# Altium schematic sheet SLIDER_PB.SchDoc
size A4; DocumentNumber: 6; Revision: C.1(PCB.SCH); SheetNumber: 6; SheetTotal: 6
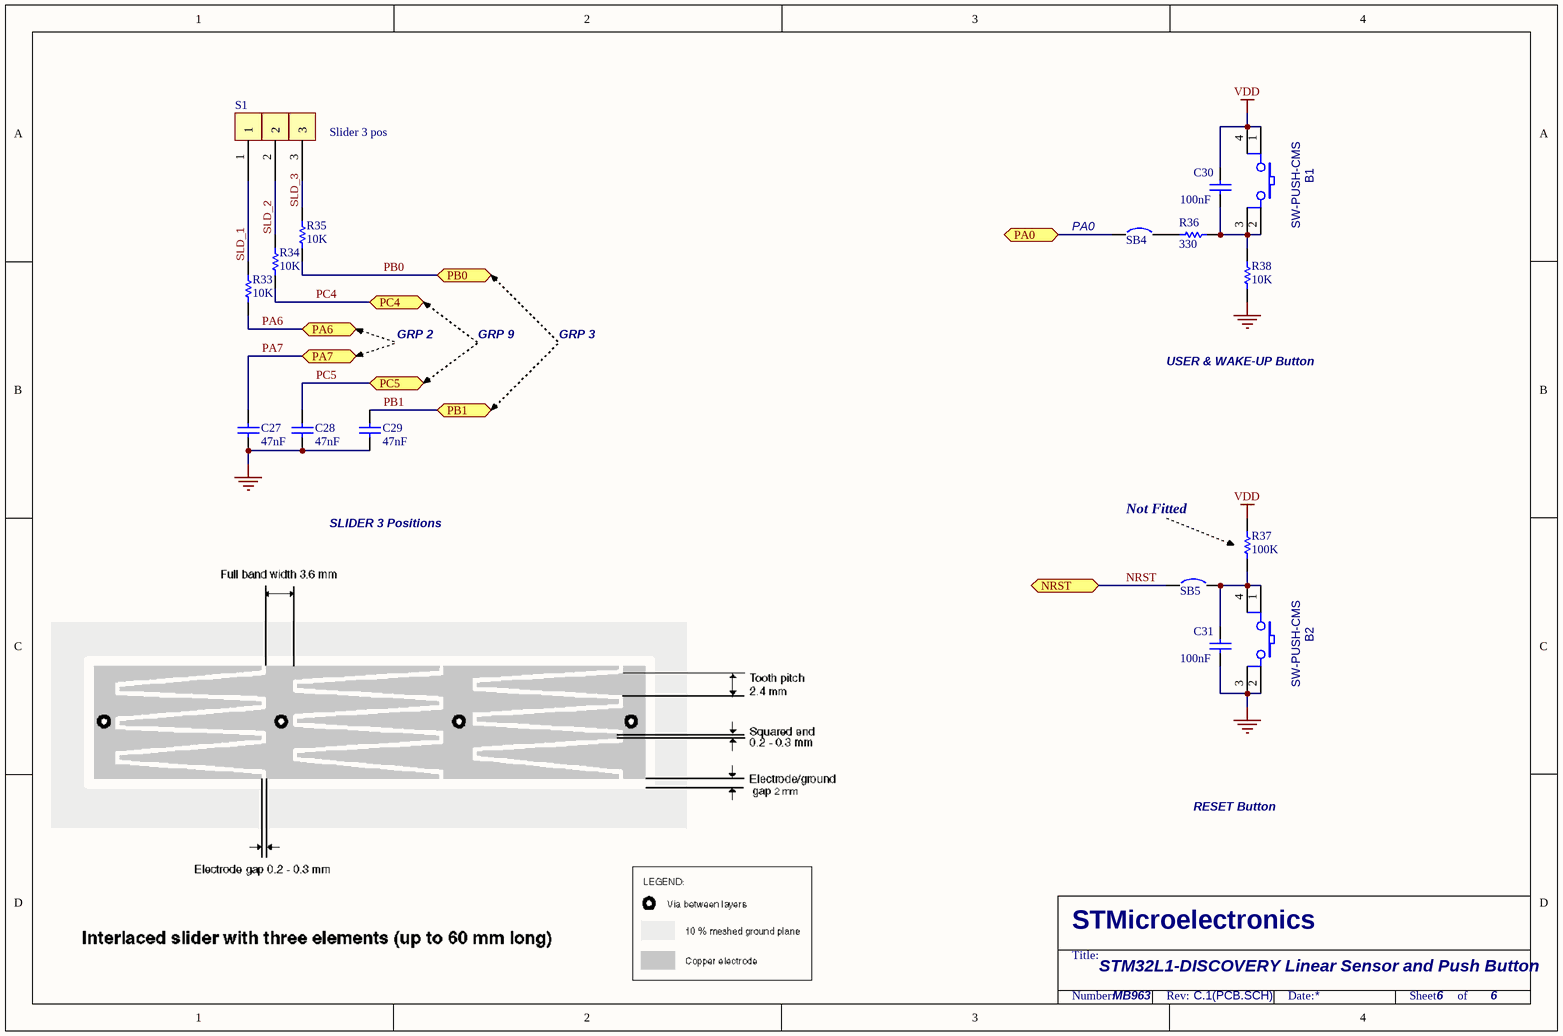
[diagram p0: SLIDER_PB.SchDoc]

## Parts
B1  SW-PUSH-CMS  [BP1CMS]
B2  SW-PUSH-CMS  [BP1CMS]
C27  47nF  [0805C]
C28  47nF  [0805C]
C29  47nF  [0805C]
C30  100nF  [0603C]
C31  100nF  [0603C]
R33  10K  [0402R]
R34  10K  [0402R]
R35  10K  [0402R]
R36  330  [0402R]
R37  100K  [0402R]
R38  10K  [0402R]
S1  Slider 3 pos  [Slider 3-2]
SB4  Circuit Breaker  [JP2_SMD]  (value not drawn)
SB5  Circuit Breaker  [JP2_SMD]  (value not drawn)

## Ports
NRST, PA0, PA6, PA7, PB0, PB1, PC4, PC5

## Nets
GND: B2.2 B2.3 C27.1 C28.1 C29.1 C31.1 R38.1
VDD: B1.1 B1.4 C30.2 R37.2
NRST: SB5.1 ; port NRST
PA0: SB4.1 ; port PA0
PA6: R33.1 ; port PA6
PA7: C27.2 ; port PA7
PB0: R35.1 ; port PB0
PB1: C29.2 ; port PB1
PC4: R34.1 ; port PC4
PC5: C28.2 ; port PC5
SLD_1: R33.2 S1.1
SLD_2: R34.2 S1.2
SLD_3: R35.2 S1.3
NetB1_2: B1.2 B1.3 C30.1 R36.2 R38.2
NetB2_1: B2.1 B2.4 C31.2 R37.1 SB5.2
NetR36_1: R36.1 SB4.2

## Notes on the sheet
- (near SB4) PA0
- GRP 2
- GRP 9
- GRP 3
- USER & WAKE-UP Button
- Not Fitted
- SLIDER 3 Positions
- RESET Button
- STM32L1-DISCOVERY Linear Sensor and Push Button
- MB963
- STMicroelectronics
- Title:
- Number:
- Rev:
- Date:
- Sheet       of

## Library data of the parts
B1 B2 = SW-PUSH-CMS: Non-Open Push-Button 0.1A 24V; Manuf_1: FARNELL; Manuf_Part_1: 535-930; Ref St: 9180120; cap_dec: ---
C27-C29 = CAP: Capacitor; Manuf_1: KEMET; Manuf_Part_1: C0805C473F8GAC; Published: 8-Jun-2000; Revision: July-2002: Re-released for DXP Platform.; Publisher: Altium Limited; Value: 47nF
C30 C31 = CAP: Capacitor; Published: 8-Jun-2000; Revision: July-2002: Re-released for DXP Platform.; Publisher: Altium Limited; Value: 100nF
R33-R36 R38 = res1: Resistor; Published: 8-Jun-2000; Revision: July-2002: Re-released for DXP Platform.; Publisher: Altium Limited
  R33-R35 R38: Value: 10K
  R36: Value: 330
R37 = res1: Resistor; Fitted: NO; Published: 8-Jun-2000; Revision: July-2002: Re-released for DXP Platform.; Publisher: Altium Limited; Value: 100K
S1 = Slider 3 pos: plan de cuivre recouvert de vernis + Couche Plastic; Description: plan de cuivre recouvert de vernis
SB4 SB5 = Circuit Breaker: Solder: YES; Published: 24-Mar-1999; Revision: July-2002: Re-released for DXP Platform.; Publisher: Altium Limited